# EAGLE design Dramco UNO (EAGLE 7.3.0)

## Sheet 1 of 2
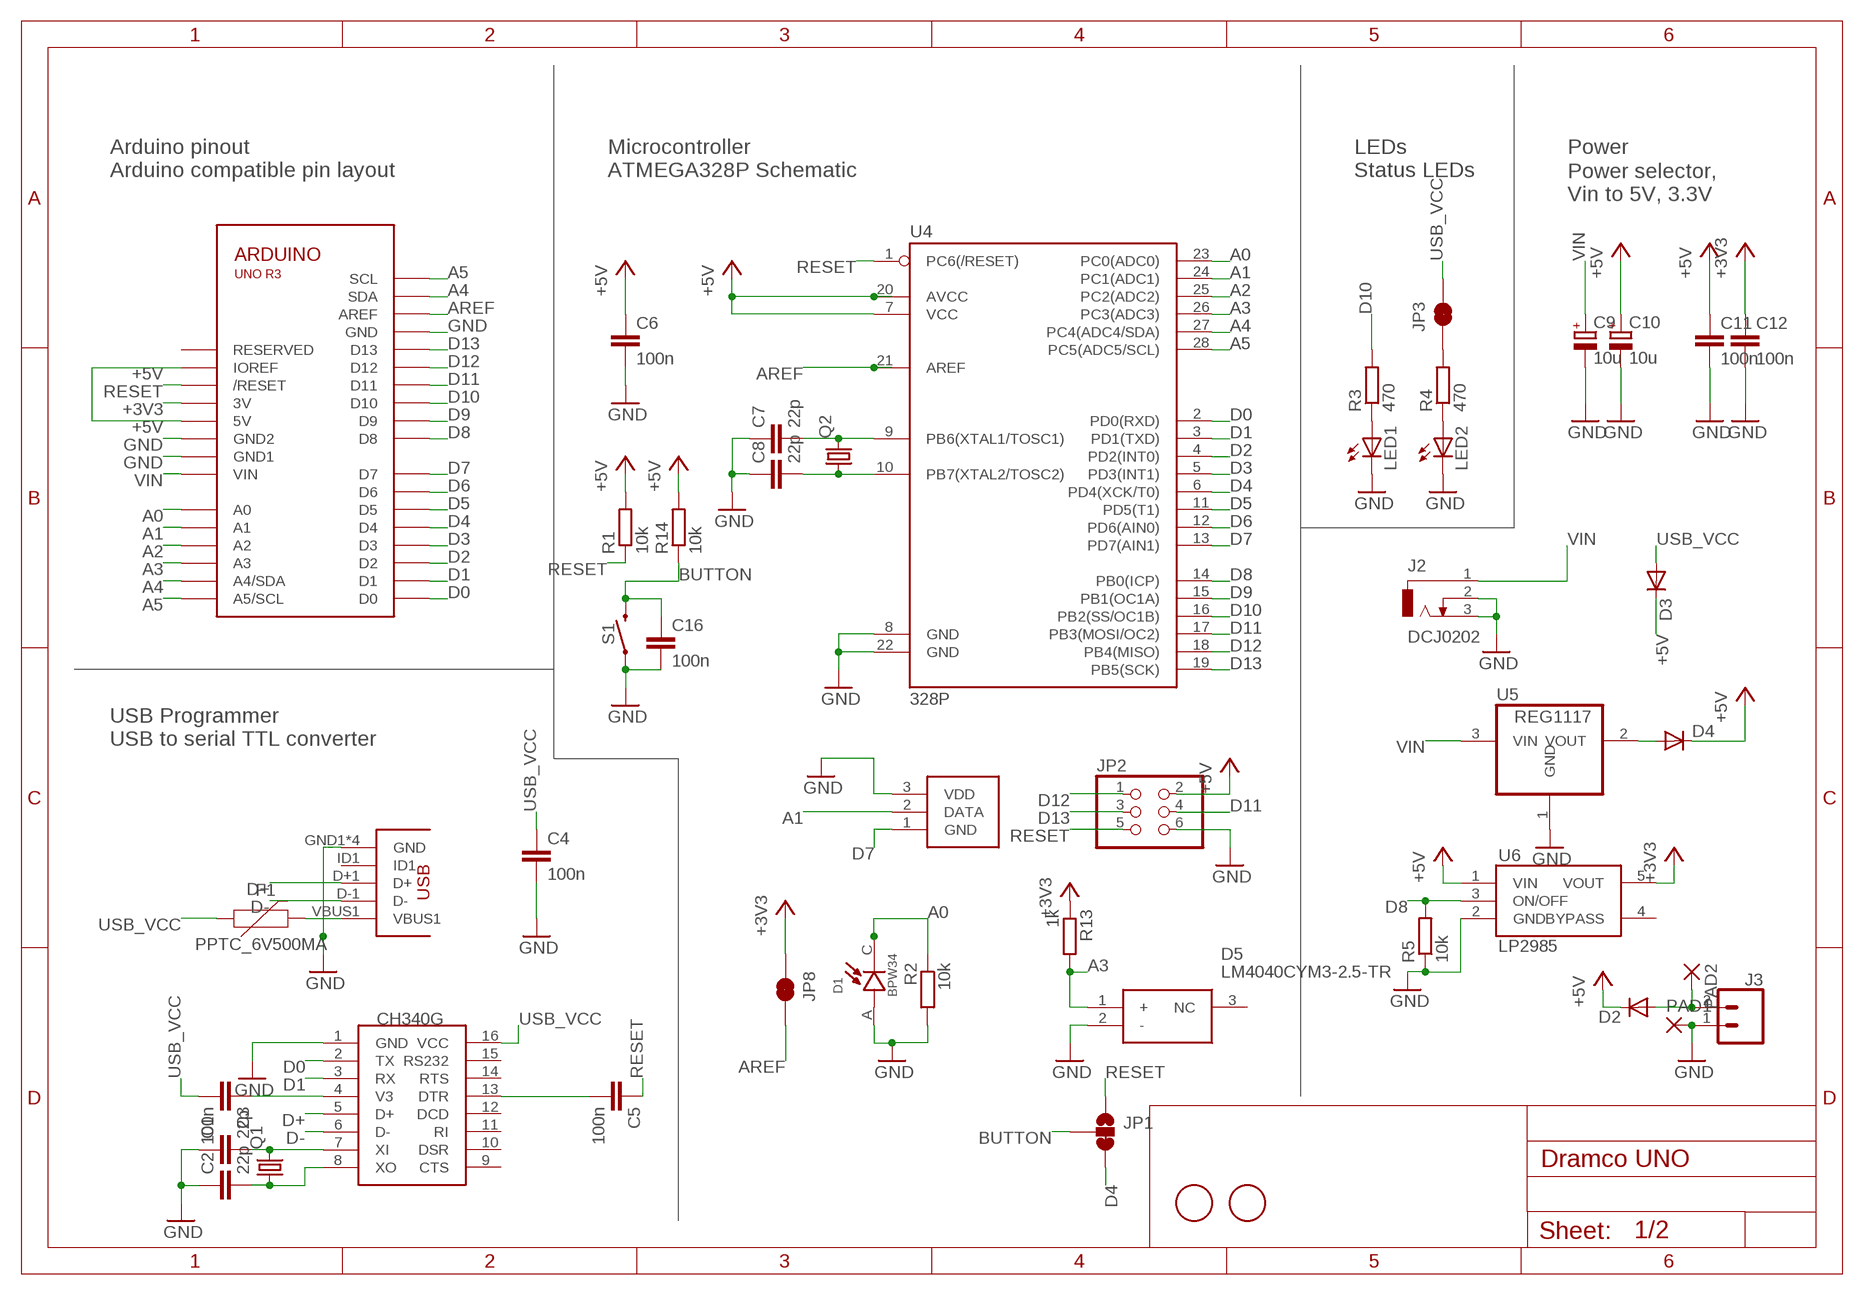
[diagram p0: schematic, sheet 1]

### Parts
C1  22p  C-EU025-024X044  [C025-024X044]
C2  22p  C-EU025-024X044  [C025-024X044]
C3  100n  C-EUC0603  [C0603]
C4  100n  C-EUC0603  [C0603]
C5  100n  C-EUC0603  [C0603]
C6  100n  C-EU025-024X044  [C025-024X044]
C7  22p  C-EU025-024X044  [C025-024X044]
C8  22p  C-EU025-024X044  [C025-024X044]
C9  10u  CPOL-EUE2-4  [E2-4]
C10  10u  CPOL-EUE2-4  [E2-4]
C11  100n  C-EUC0603  [C0603]
C12  100n  C-EUC0603  [C0603]
C16  100n  C-EUC0603  [C0603]
D1  BPW34  [DIO_BPW34]
D2  DIODE-D-5  [D-5]
D3  DIODE-D-5  [D-5]
D4  DIODE-D-5  [D-5]
D5  LM4040CYM3-2.5-TR  [SOT95P235X111-3N]
F1  PPTC_6V500MA  [0805]
J1  USB-AB  [USB-AB-MICRO-SMD_V02_BOSS]
J2  DCJ0202  [DCJ0202]
J3  CONN_02JST-PTH-2  [JST-2-PTH]
JP1  JUMPER-SMT_3_1-NC_TRACE_SILK  [SMT-JUMPER_3_1-NC_TRACE_SILK]
JP2  PINHD-2X3  [2X03]
JP3  JUMPER-SMT_2_NC_TRACE_NO-SILK  [SMT-JUMPER_2_NC_TRACE_NO-SILK]
JP8  JUMPER-SMT_2_NC_TRACE_NO-SILK  [SMT-JUMPER_2_NC_TRACE_NO-SILK]
LED1  LED5MM  [LED5MM]
LED2  LED5MM  [LED5MM]
PAD1  SMD2  [SMD1,27-2,54]
PAD2  SMD2  [SMD1,27-2,54]
Q1  CRYSTALHC49S  [HC49/S]
Q2  CRYSTALHC49S  [HC49/S]
R1  10k  R-EU_0204/7  [0204/7]
R2  10k  R-EU_0204/7  [0204/7]
R3  470  R-EU_0204/7  [0204/7]
R4  470  R-EU_0204/7  [0204/7]
R5  10k  R-EU_R0603  [R0603]
R13  1k  R-EU_R0603  [R0603]
R14  10k  R-EU_R0603  [R0603]
S1  MOMENTARY-SWITCH-SPST-PTH-6.0MM  [TACTILE_SWITCH_PTH_6.0MM]
U1  ARDUINOR3-DIMENSION  [ARDUINOR3]
U2  CH340G  [SOIC16]
U3  DS18B20-TO92  [TO92-]
U4  328P  ATMEGA328P_PDIP  [DIP28]
U5  REG1117  [SOT223]
U6  LP2985AIM5-3.3  [SOT25]
X1  FIDUCIAL  [FIDUCIAL_1MM]
X2  FIDUCIAL  [FIDUCIAL_1MM]

### Nets
+3V3: C12.1 JP8.1 R13.1 U1.3V U6.5(VOUT) ; also sheet 2
+5V: C6.1 C10.+ C11.1 D2.C D3.C D4.C JP2.2 R1.2 R14.2 U1.5V U1.IOREF U4.7(VCC) U4.20(AVCC) U6.1(VIN) ; also sheet 2
A0: D1.C R2.1 U1.A0 U4.23(PC0(ADC0))
A1: U1.A1 U3.2(DATA) U4.24(PC1(ADC1))
A2: U1.A2 U4.25(PC2(ADC2))
A3: D5.1(+) R13.2 U1.A3 U4.26(PC3(ADC3))
A4: U1.A4(A4/SDA) U1.SDA U4.27(PC4(ADC4/SDA)) ; also sheet 2
A5: U1.A5(A5/SCL) U1.SCL U4.28(PC5(ADC5/SCL)) ; also sheet 2
AREF: JP8.2 U1.AREF U4.21(AREF)
BUTTON: C16.1 JP1.2 R14.1 S1.3
D0: U1.D0 U2.2(TX) U4.2(PD0(RXD))
D1: U1.D1 U2.3(RX) U4.3(PD1(TXD))
D2: U1.D2 U4.4(PD2(INT0)) ; also sheet 2
D3: U1.D3 U4.5(PD3(INT1)) ; also sheet 2
D4: JP1.3 U1.D4 U4.6(PD4(XCK/T0)) ; also sheet 2
D5: U1.D5 U4.11(PD5(T1)) ; also sheet 2
D6: U1.D6 U4.12(PD6(AIN0)) ; also sheet 2
D7: U1.D7 U3.1(GND) U4.13(PD7(AIN1))
D8: R5.2 U1.D8 U4.14(PB0(ICP)) U6.3(ON/OFF)
D9: U1.D9 U4.15(PB1(OC1A)) ; also sheet 2
D10: R3.2 U1.D10 U4.16(PB2(SS/OC1B))
D11: JP2.4 U1.D11 U4.17(PB3(MOSI/OC2)) ; also sheet 2
D12: JP2.1 U1.D12 U4.18(PB4(MISO)) ; also sheet 2
D13: JP2.3 U1.D13 U4.19(PB5(SCK)) ; also sheet 2
D+: J1.D+1(D+) U2.5(D+)
D-: J1.D-1(D-) U2.6(D-)
GND: C1.1 C2.1 C4.2 C6.2 C7.1 C8.1 C9.- C10.- C11.2 C12.2 C16.2 D1.A D5.2(-) J1.GND1(GND) J1.P$1(GND) J1.P$2(GND) J1.P$3(GND) J2.2 J2.3 J3.1 JP2.6 LED1.K(C) LED2.K(C) PAD1.1(P) R2.2 R5.1 S1.1 U1.GND U1.GND1 U1.GND2 U2.1(GND) U3.3(VDD) U4.8(GND) U4.22(GND) U5.1(GND) U6.2(GND) ; also sheet 2
N$1: C7.2 Q2.2 U4.9(PB6(XTAL1/TOSC1))
N$2: C8.2 Q2.1 U4.10(PB7(XTAL2/TOSC2))
N$3: C1.2 Q1.2 U2.7(XI)
N$4: C2.2 Q1.1 U2.8(XO)
N$5: C3.1 U2.4(V3)
N$6: LED1.A R3.1
N$7: LED2.A R4.1
N$8: C5.2 U2.13(DTR)
N$9: D4.A U5.2(VOUT)
N$10: F1.2 J1.VBUS1
N$12: JP3.1 R4.2
RESET: C5.1 JP1.1 JP2.5 R1.1 U1.RESET(/RESET) U4.1(PC6(/RESET))
USB_VCC: C3.2 C4.1 D3.A F1.1 JP3.2 U2.16(VCC)
VBAT: D2.A J3.2 PAD2.1(P)
VIN: C9.+ J2.1 U1.VIN U5.3(VIN)
Unconnected: D5.3(NC) J1.ID1 U1.RESERVED U2.9(CTS) U2.10(DSR) U2.11(RI) U2.12(DCD) U2.14(RTS) U2.15(RS232) U6.4(BYPASS)

### Notes on the sheet
- Arduino pinout | Microcontroller | LEDs | Power
- Power selector, 
  Vin to 5V, 3.3V
- Arduino compatible pin layout | ATMEGA328P Schematic | Status LEDs
- USB Programmer
- USB to serial TTL converter

## Sheet 2 of 2
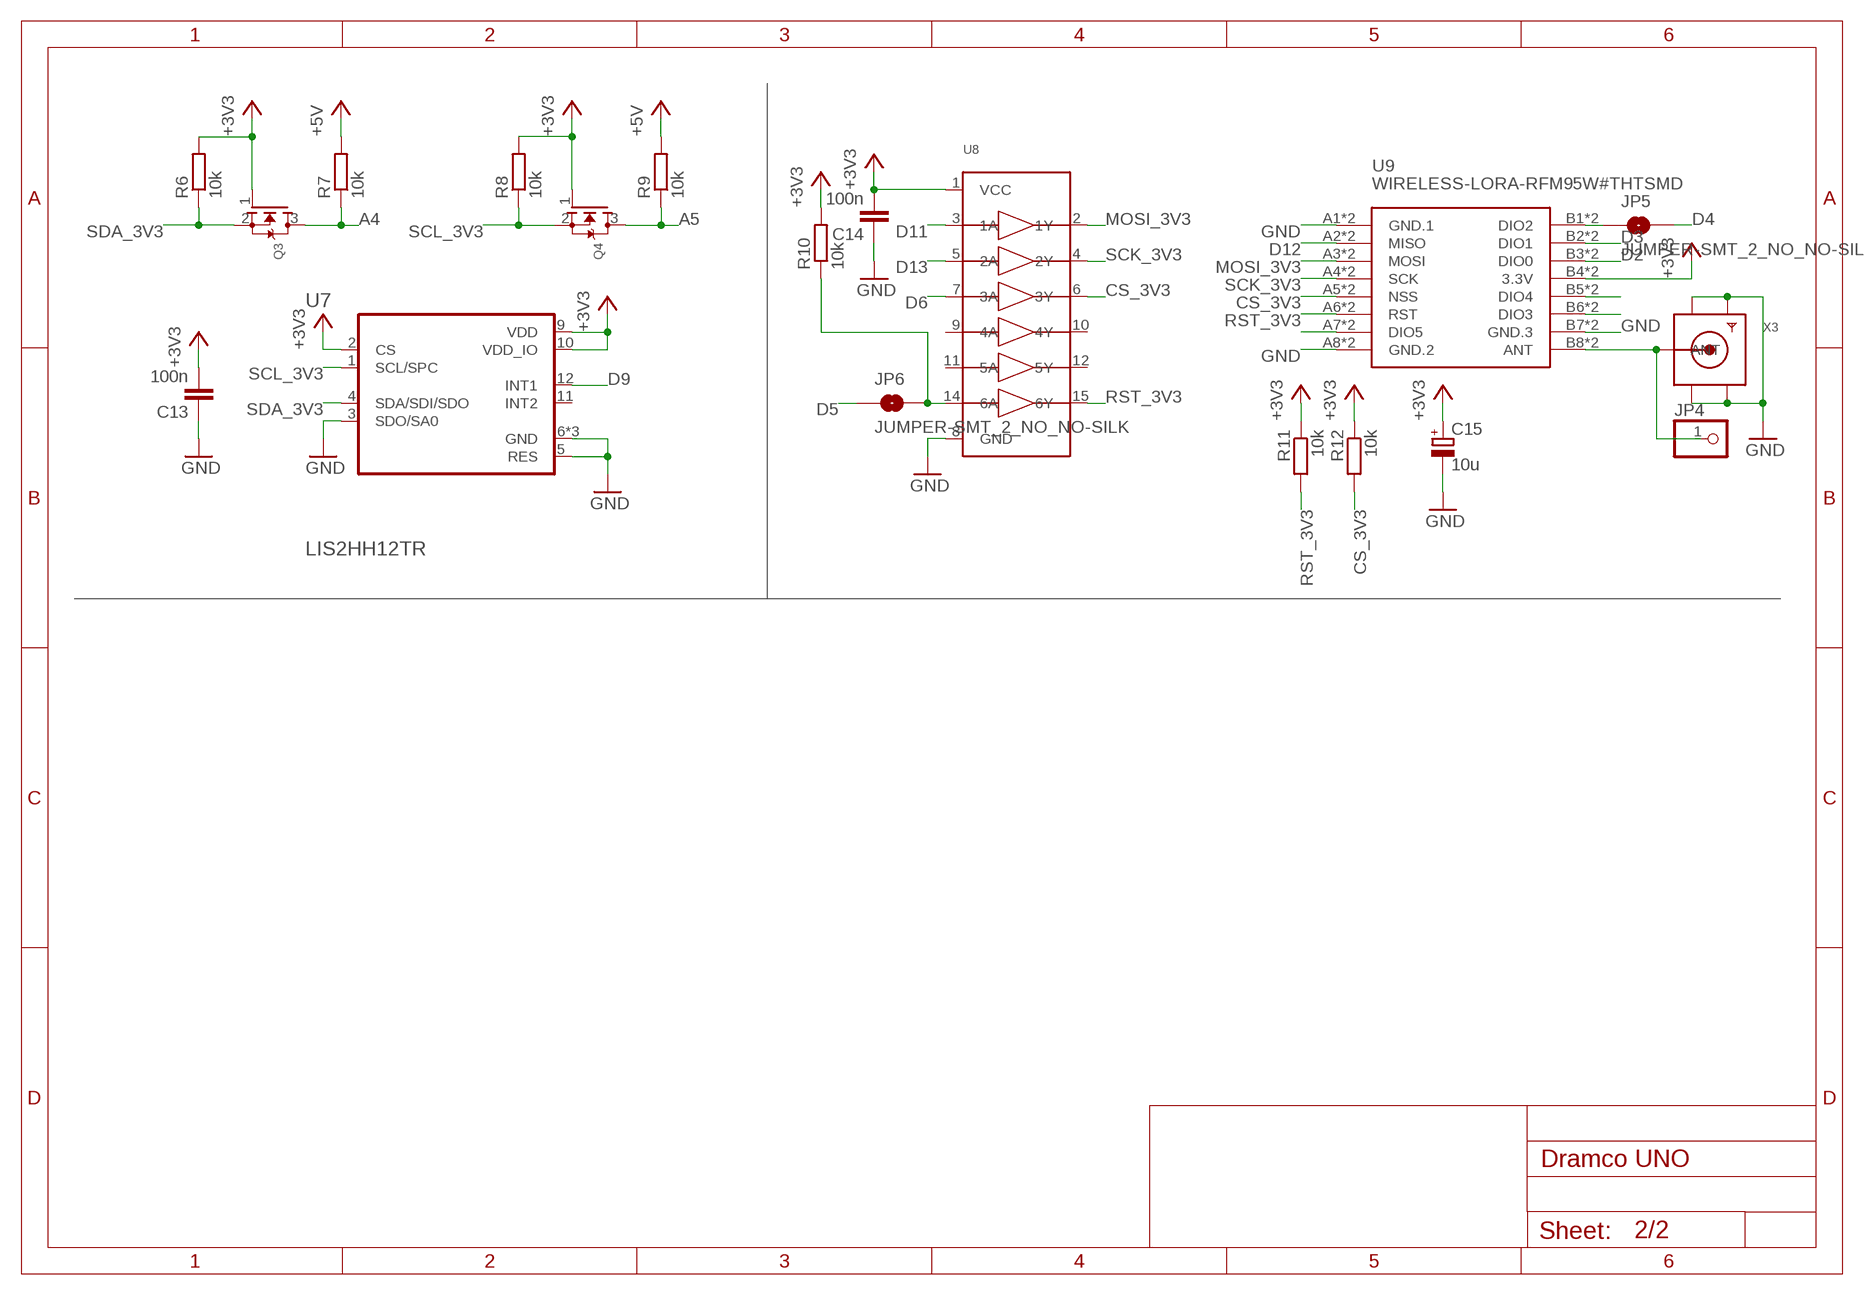
[diagram p1: schematic, sheet 2]

### Parts
C13  100n  C-EUC0603  [C0603]
C14  100n  C-EUC0603  [C0603]
C15  10u  CPOL-EUE2-4  [E2-4]
JP4  PINHD-1X1  [1X01]
JP5  JUMPER-SMT_2_NO_NO-SILK  [SMT-JUMPER_2_NO_NO-SILK]
JP6  JUMPER-SMT_2_NO_NO-SILK  [SMT-JUMPER_2_NO_NO-SILK]
Q3  MOSFET-NREFLOW  [SOT23]
Q4  MOSFET-NREFLOW  [SOT23]
R6  10k  R-EU_R0603  [R0603]
R7  10k  R-EU_R0603  [R0603]
R8  10k  R-EU_R0603  [R0603]
R9  10k  R-EU_R0603  [R0603]
R10  10k  R-EU_R0603  [R0603]
R11  10k  R-EU_0204/7  [0204/7]
R12  10k  R-EU_0204/7  [0204/7]
U7  LIS2HH12TR  [PQFN50P200X200X100-12N]
U8  74HC4050DTSSOP  [TSSOP16]
U9  WIRELESS-LORA-RFM95W#THTSMD  [WIRELESS-LORA-RFM95W#THTSMD]
X3  SMACONNECTOR_EDGE_UFL  [SMA_EDGELAUNCH_UFL]

### Nets
+3V3: C13.2 C14.2 C15.+ Q3.1(G) Q4.1(G) R6.2 R8.2 R10.2 R11.1 R12.1 U7.2(CS) U7.9(VDD) U7.10(VDD_IO) U8.1(VCC) U9.B4(3.3V) U9.B12(3.3V) ; also sheet 1
+5V: R7.2 R9.2 ; also sheet 1
A4: Q3.3(D) R7.1 ; also sheet 1
A5: Q4.3(D) R9.1 ; also sheet 1
CS_3V3: R12.2 U8.6(3Y) U9.A5(NSS) U9.A13(NSS)
D2: U9.B3(DIO0) U9.B11(DIO0) ; also sheet 1
D3: U9.B2(DIO1) U9.B10(DIO1) ; also sheet 1
D4: JP5.2 ; also sheet 1
D5: JP6.1 ; also sheet 1
D6: U8.7(3A) ; also sheet 1
D9: U7.12(INT1) ; also sheet 1
D11: U8.3(1A) ; also sheet 1
D12: U9.A2(MISO) U9.A10(MISO) ; also sheet 1
D13: U8.5(2A) ; also sheet 1
GND: C13.1 C14.1 C15.- U7.3(SDO/SA0) U7.5(RES) U7.6(GND) U7.7(GND) U7.8(GND) U8.8(GND) U9.A1(GND.1) U9.A8(GND.2) U9.A9(GND.1) U9.A16(GND.2) U9.B7(GND.3) U9.B15(GND.3) X3.GND@1(GND1) X3.GND@2(GND2) X3.GND@3(GND3) X3.GND@4(GND4) ; also sheet 1
MOSI_3V3: U8.2(1Y) U9.A3(MOSI) U9.A11(MOSI)
N$11: JP4.1 U9.B8(ANT) U9.B16(ANT) X3.P(ANT)
N$13: JP5.1 U9.B1(DIO2) U9.B9(DIO2)
N$14: JP6.2 R10.1 U8.14(6A)
N$25: U9.A7(DIO5) U9.A15(DIO5)
N$30: U9.B5(DIO4) U9.B13(DIO4)
N$31: U9.B6(DIO3) U9.B14(DIO3)
RST_3V3: R11.2 U8.15(6Y) U9.A6(RST) U9.A14(RST)
SCK_3V3: U8.4(2Y) U9.A4(SCK) U9.A12(SCK)
SCL_3V3: Q4.2(S) R8.1 U7.1(SCL/SPC)
SDA_3V3: Q3.2(S) R6.1 U7.4(SDA/SDI/SDO)
Unconnected: U7.11(INT2) U8.9(4A) U8.10(4Y) U8.11(5A) U8.12(5Y)

## Library data of the parts
C1-C8 C16 = resistor:C-EU: CAPACITOR, European symbol
C9 C10 C15 = rcl:CPOL-EU: POLARIZED CAPACITOR, European symbol
C11-C14 = rcl:C-EU: CAPACITOR, European symbol
D1 = BPW34:BPW34: PIN IR photodiode; DIL; 400-1100nm; 150mW; 60°; λp max:; AVAILABILITY: Unavailable; DESCRIPTION: PIN IR photodiode; DIL; 400-1100nm; 150mW; 60°; λp max:; MF: Vishay Semiconductor; MP: BPW34; PACKAGE: DIP-2 Osram Opto; PRICE: None
D2-D4 = diode:DIODE-: DIODE
D5 = SamacSys_Parts:LM4040CYM3-2.5-TR: Voltage References Source: Datasheet <https://componentsearchengine.com/Datasheets/1/LM4040CYM3-2.5-TR.pdf>; DESCRIPTION: Voltage References; HEIGHT: 1.11mm; MANUFACTURER_NAME: Microchip; MANUFACTURER_PART_NUMBER: LM4040CYM3-2.5-TR; MOUSER_PART_NUMBER: 998-LM4040CYM3-2.5TR; MOUSER_PRICE-STOCK: https://www.mouser.co.uk/ProductDetail/Microchip-Technology-Micrel/LM4040CYM3-25-TR/?qs=Y3Q3JoKAO1TBY3WS5dYgqA%3D%3D
F1 = SparkFun-Fuses:PPTC: Resettable Fuse PPTC Resettable Fuse. Really a sort of resistor with a polymeric positive temperature coefficient whose resistance increases dramatically with an increase in temperature. When heated by the power passing through the resistance rises causing the current to be limited, protecting the circuit. This is achieved by the transition of the polymer from a crystalline to an amorphous state where the conductive carbon separates breaking the conductive pathways found in the cool crystalline structure. When a PPTC cools back down it resumes conducting letting the circuit turn back on. SparkFun Products: SparkFun RedBoard - Programmed with Arduino <https://www.sparkfun.com/products/12757> Pro Micro - 5V/16MHz <https://www.sparkfun.com/products/12640> Arduino Pro 328 - 5V/16MHz <https://www.sparkfun.com/products/10915> MP3 Trigger <https://www.sparkfun.com/products/13720>
J1 = Testing:USB-AB
J2 = con-jack:DCJ0202: DC POWER JACK Source: DCJ0202.pdf; OC_FARNELL: unknown; OC_NEWARK: unknown
J3 = SparkFun-Connectors:CONN_02: Multi connection point. Often used as Generic Header-pin footprint for 0.1 inch spaced/style header connections On any of the 0.1 inch spaced packages, you can populate with these: Break Away Headers - Straight <https://www.sparkfun.com/products/116> (PRT-00116) Break Away Male Headers - Right Angle <https://www.sparkfun.com/products/553> (PRT-00553) Female Headers <https://www.sparkfun.com/products/115> (PRT-00115) Break Away Headers - Machine Pin <https://www.sparkfun.com/products/117> (PRT-00117) Break Away Female Headers - Swiss Machine Pin <https://www.sparkfun.com/products/743> (PRT-00743) For SCREWTERMINALS and SPRING TERMINALS visit here: Screw Terimnals on SparkFun.com <https://www.sparkfun.com/search/results?term=Screw+Terminals> (5mm/3.5mm/2.54mm spacing) This device is also useful as a general connection point to wire up your design to another part of your project. Our various solder wires solder well into these plated through hole pads. Hook-Up Wire - Assortment (Stranded, 22 AWG) <https://www.sparkfun.com/products/11375> (PRT-11375) Hook-Up Wire - Assortment (Solid Core, 22 AWG) <https://www.sparkfun.com/products/11367> (PRT-11367) View the entire wire category on our website here <https://www.sparkfun.com/categories/141> Special notes: Molex polarized connector foot print use with: PRT-08233 with associated crimp pins and housings. 2.54_SCREWTERM for use with PRT-10571. 3.5mm Screw Terminal footprints for PRT-08084 5mm Screw Terminal footprints for use with PRT-08432; PROD_ID: CONN-09863; SKU: PRT-09914
JP1 = SparkFun-Jumpers:JUMPER-SMT_3_1-NC_TRACE: Normally closed trace jumper (1 of 2 connections) This jumper has a trace between two pads so it's normally closed (NC). The other connection is normally open (NO). Use a razor knife to open the connection. For best results follow the IPC guidelines for cutting traces: Cutout at least 0.063 mm (0.005 in). Remove all loose material to clean up the cut area. Seal the cut with an approved epoxy. Reapply solder to reclose the connection, or to close the NO connection.
JP2 = pinhead:PINHD-2X3: PIN HEADER
JP3 JP8 = SparkFun-Jumpers:JUMPER-SMT_2_NC_TRACE: Normally closed trace jumper This jumper has a trace between two pads so it's normally closed (NC). Use a razor knife to open the connection. For best results follow the IPC guidelines for cutting traces: Cutout at least 0.063 mm (0.005 in). Remove all loose material to clean up the cut area. Seal the cut with an approved epoxy. Reapply solder to reclose the connection.
JP4 = pinhead:PINHD-1X1: PIN HEADER
JP5 JP6 = SparkFun-Jumpers:JUMPER-SMT_2_NO: Normally open jumper This jumper has two pads in close proximity to each other. Apply solder to close the connection. Round pads are easier to solder for beginners, but are a lot larger. SparkFun Product that uses the round pads: SparkFun EL Sequencer <https://www.sparkfun.com/products/12781>
LED1 LED2 = adafruit:LED: LED OSRAM: - CHIPLED LG R971, LG N971, LY N971, LG Q971, LY Q971, LO R971, LY R971 LH N974, LH R974 LS Q976, LO Q976, LY Q976 LO Q996 - Hyper CHIPLED LW Q18S LB Q993, LB Q99A, LB R99A - SideLED LS A670, LO A670, LY A670, LG A670, LP A670 LB A673, LV A673, LT A673, LW A673 LH A674 LY A675 LS A676, LA A676, LO A676, LY A676, LW A676 LS A679, LY A679, LG A679 - Hyper Micro SIDELED® LS Y876, LA Y876, LO Y876, LY Y876 LT Y87S - SmartLED LW L88C, LW L88S LB L89C, LB L89S, LG L890 LS L89K, LO L89K, LY L89K LS L896, LA L896, LO L896, LY L896 - TOPLED LS T670, LO T670, LY T670, LG T670, LP T670 LSG T670, LSP T670, LSY T670, LOP T670, LYG T670 LG T671, LOG T671, LSG T671 LB T673, LV T673, LT T673, LW T673 LH T674 LS T676, LA T676, LO T676, LY T676, LB T676, LH T676, LSB T676, LW T676 LB T67C, LV T67C, LT T67C, LS T67K, LO T67K, LY T67K, LW E67C LS E67B, LA E67B, LO E67B, LY E67B, LB E67C, LV E67C, LT E67C LW T67C LS T679, LY T679, LG T679 LS T770, LO T770, LY T770, LG T770, LP T770 LB T773, LV T773, LT T773, LW T773 LH T774 LS E675, LA E675, LY E675, LS T675 LS T776, LA T776, LO T776, LY T776, LB T776 LHGB T686 LT T68C, LB T68C - Hyper Mini TOPLED® LB M676 - Mini TOPLED Santana® LG M470 LS M47K, LO M47K, LY M47K Source: http://www.osram.convergy.de/
PAD1 PAD2 = wirepad:SMD2: SMD PAD
Q1 Q2 = adafruit:CRYSTAL: CRYSTAL; OC_FARNELL: 1667008; OC_NEWARK: unknown
Q3 Q4 = adafruit:MOSFET-N: N-Channel Mosfet 2N7002E - 60V 260mA SOT23 [Digikey: 2N7002ET1GOSTR-ND] - REEL BSH103 - 30V 850mA SOT23 [Digikey: 568-5013-1-ND]
R1-R4 R11 R12 = resistor:R-EU_: RESISTOR, European symbol
R5-R10 R13 R14 = rcl:R-EU_: RESISTOR, European symbol
S1 = SparkFun-Switches:MOMENTARY-SWITCH-SPST: Momentary Switch (Pushbutton) - SPST Normally-open (NO) SPST momentary switches (buttons, pushbuttons). Variants PTH-12MM - 12mm square, through-hole Momentary Pushbutton Switch - 12mm Square <https://www.sparkfun.com/products/9190> (COM-09190) PTH-6.0MM, PTH-6.0MM-KIT - 6.0mm square, through-hole Mini Pushbutton Switch <https://www.sparkfun.com/products/97> (COM-00097) KIT package intended for soldering kit's - only one side of pads' copper is exposed. PTH-RIGHT-ANGLE-KIT - Right-angle, through-hole Right Angle Tactile Button <https://www.sparkfun.com/products/10791> - Used on SparkFun BigTime Watch Kit <https://www.sparkfun.com/products/11734> SMD-12MM - 12mm square, surface-mount Tactile Button - SMD (12mm) <https://www.sparkfun.com/products/12993> (COM-12993) Used on SparkFun PicoBoard <https://www.sparkfun.com/products/11888> SMD-4.5MM - 4.5mm Square Trackball Switch Used on SparkFun Blackberry Trackballer Breakout <https://www.sparkfun.com/products/13169> SMD-4.6MMX2.8MM - 4.60mm x 2.80mm, surface mount Used on SparkFun SAMD21 Mini Breakout <https://www.sparkfun.com/products/13664> SMD-5.2MM, SMD-5.2-REDUNDANT - 5.2mm square, surface-mount Mini Pushbutton Switch - SMD <https://www.sparkfun.com/products/8720> (COM-08720) Used on Arduino Pro Mini <https://www.sparkfun.com/products/11114> REDUNDANT package connects both switch circuits together SMD-6.0X3.5MM - 6.0 x 3.5mm, surface mount Momentary Reset Switch SMD <https://www.sparkfun.com/products/8229> (COM-08229) SMD-6.2MM-TALL - 6.2mm square, surface mount Tactile Button - SMD (6mm) <https://www.sparkfun.com/products/12992> Used on SparkFun Digital Sandbox <https://www.sparkfun.com/products/12651> SMD-RIGHT-ANGLE - Right-angle, surface mount Used on SparkFun Block for Intel® Edison - Arduino <https://www.sparkfun.com/products/13036>; PROD_ID: SWCH-08441; SF_SKU: COM-00097
U1 = adafruit:ARDUINOR3: This is a new object for the new Arduino R3 - with extra pins that you may want to use (such as IOref, and duplicated A4/A5
U2 = ch340g:CH340G
U3 = 1wire:DS18B20-
U4 = SparkFun-IC-Microcontroller:ATMEGA328P_PDIP: Atmel 328P Through hole ATMEGA328P uC used in the Arduino 32kb flash, 1k EEPROM, 2k SRAM Datasheet <http://www.sparkfun.com/datasheets/Components/SMD/ATMega328.pdf> SparkFun Products Storefront component: AVR 28 Pin 20MHz 32K 6A/D - ATMega328P <https://www.sparkfun.com/products/9061> (COM-09061) SparkFun Simon Says - Through-Hole Soldering Kit <https://www.sparkfun.com/products/10547> (KIT-10547) SparkFun Learn to Solder - Simon Says <https://www.sparkfun.com/products/13708> (KIT-13708) SparkFun BigTime Watch Kit <https://www.sparkfun.com/products/11734> (KIT-11734) SparkFun ClockIt <https://www.sparkfun.com/products/10930> (KIT-10930) SparkFun Serial Enabled LCD Kit <https://www.sparkfun.com/products/10097> (LCD-10097) SparkFun Simon Tilts - Through Hole Soldering Kit <https://www.sparkfun.com/products/12634> (KIT-12634) SparkFun Frequency Counter Kit <https://www.sparkfun.com/products/10140> (KIT-10140) FabFM Radio Kit <https://www.sparkfun.com/products/11043> (KIT-11043) SparkFun Binary Blaster Kit <https://www.sparkfun.com/products/12037> (KIT-12037) SparkFun Metro-Gnome <https://www.sparkfun.com/products/9236> (KIT-09236) ATmega328 with Arduino Optiboot (Uno) <https://www.sparkfun.com/products/10524> (DEV-10524); PROD_ID: IC-09136
U5 = burr-brown:REG1117: 800mA and 1A Low Dropout (LDO) Positive Regulator 1.8V, 2.5V, 2.85V, 3.3V, 5V, and Adj; MPN: REG1117; OC_FARNELL: 1097566; OC_NEWARK: 14P6981
U6 = LP2985:LP2985: LP2985-N Micropower 150 mA Low-Noise Ultra Low-Dropout Regulator
U7 = LIS2HH12TR:LIS2HH12TR: MEMS digital output motion sensor: ultra low-power high performance 3-axes "pico" accelerometer; AVAILABILITY: Unavailable; DESCRIPTION: MEMS digital output motion sensor: ultra low-power high performance 3-axes pico accelerometer; MF: STMicroelectronics; MP: LIS2HH12TR; PACKAGE: LGA-12 STMicroelectronics; PRICE: None
U8 = microbuilder:74HC4050D: 6-channel level shifter 74HC4050D - 2V-6V Supply SOIC16 Digikey: 74HC4050D,653-ND Mouser: 771-74HC4050D-T TSSOP16 Digikey: 296-9215-1-ND Mouser:
U9 = diy-modules:WIRELESS-LORA-RFM95W: 868/915 MHz LoRa Radio Transceiver Module based on SX1276 chip Click here to find device on ebay.com <http://www.ebay.com/sch/RFM95W+transceiver>
X1 X2 = adafruit:FIDUCIAL: For use by pick and place machines to calibrate the vision/machine, 1mm By microbuilder.eu
X3 = adafruit:SMACONNECTOR: SMA Connector 90° DIP SMA Connector, 50 Ohm (4UConnector: 07259)

## Net classes
0 default: clearance 0.205 mm

## Board
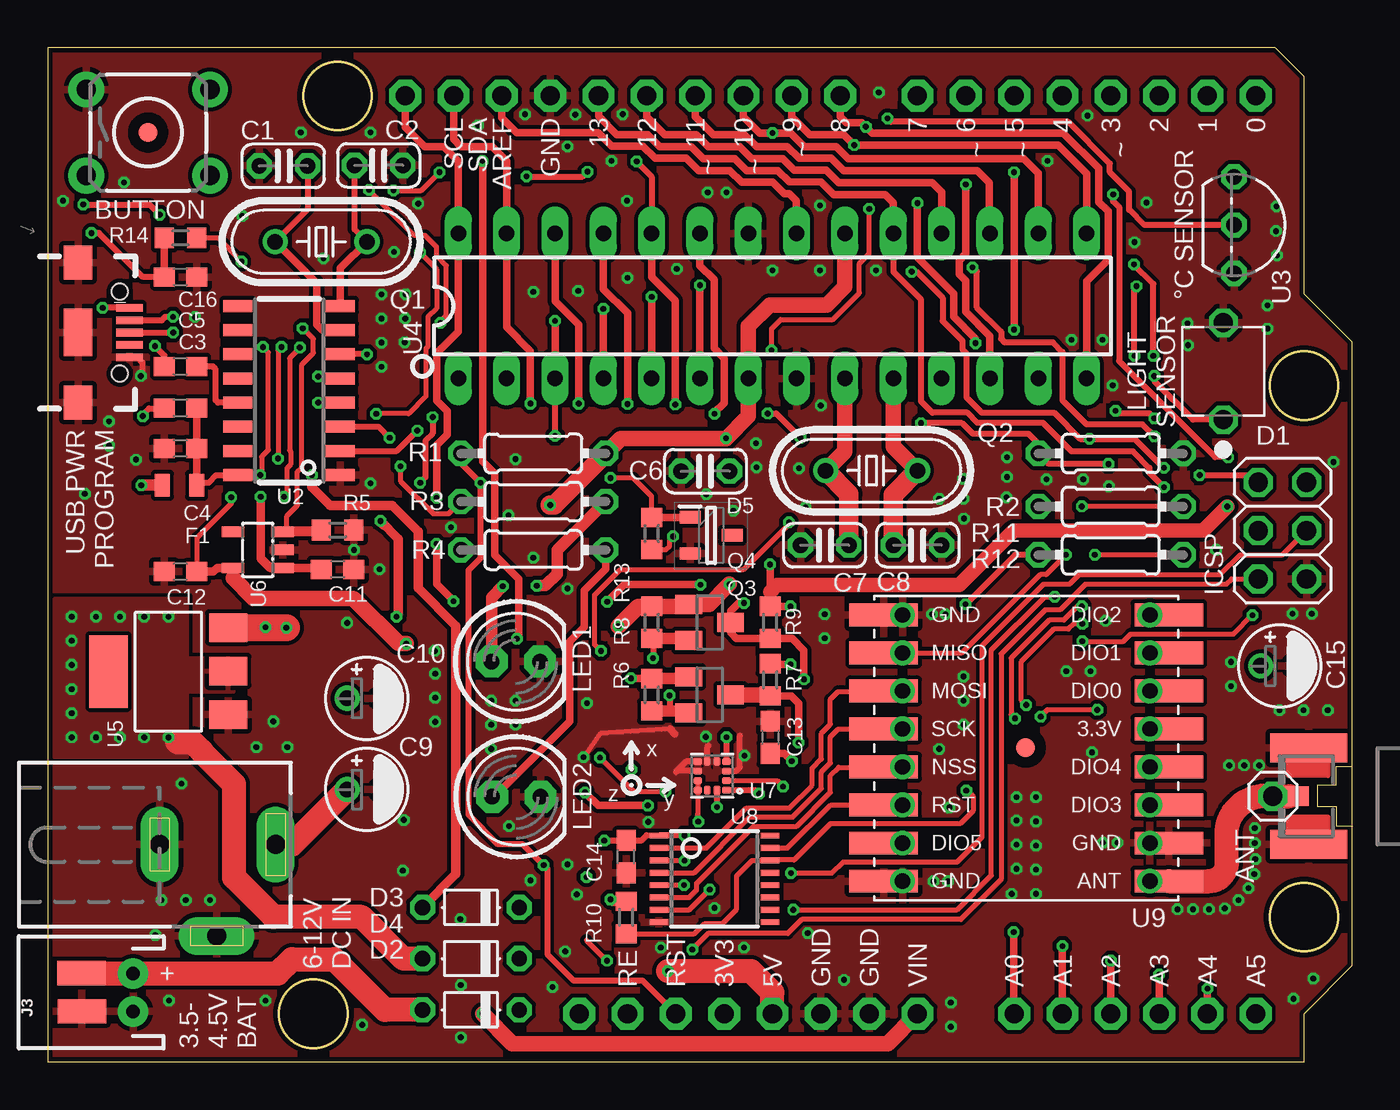
[diagram p2: board, top side]
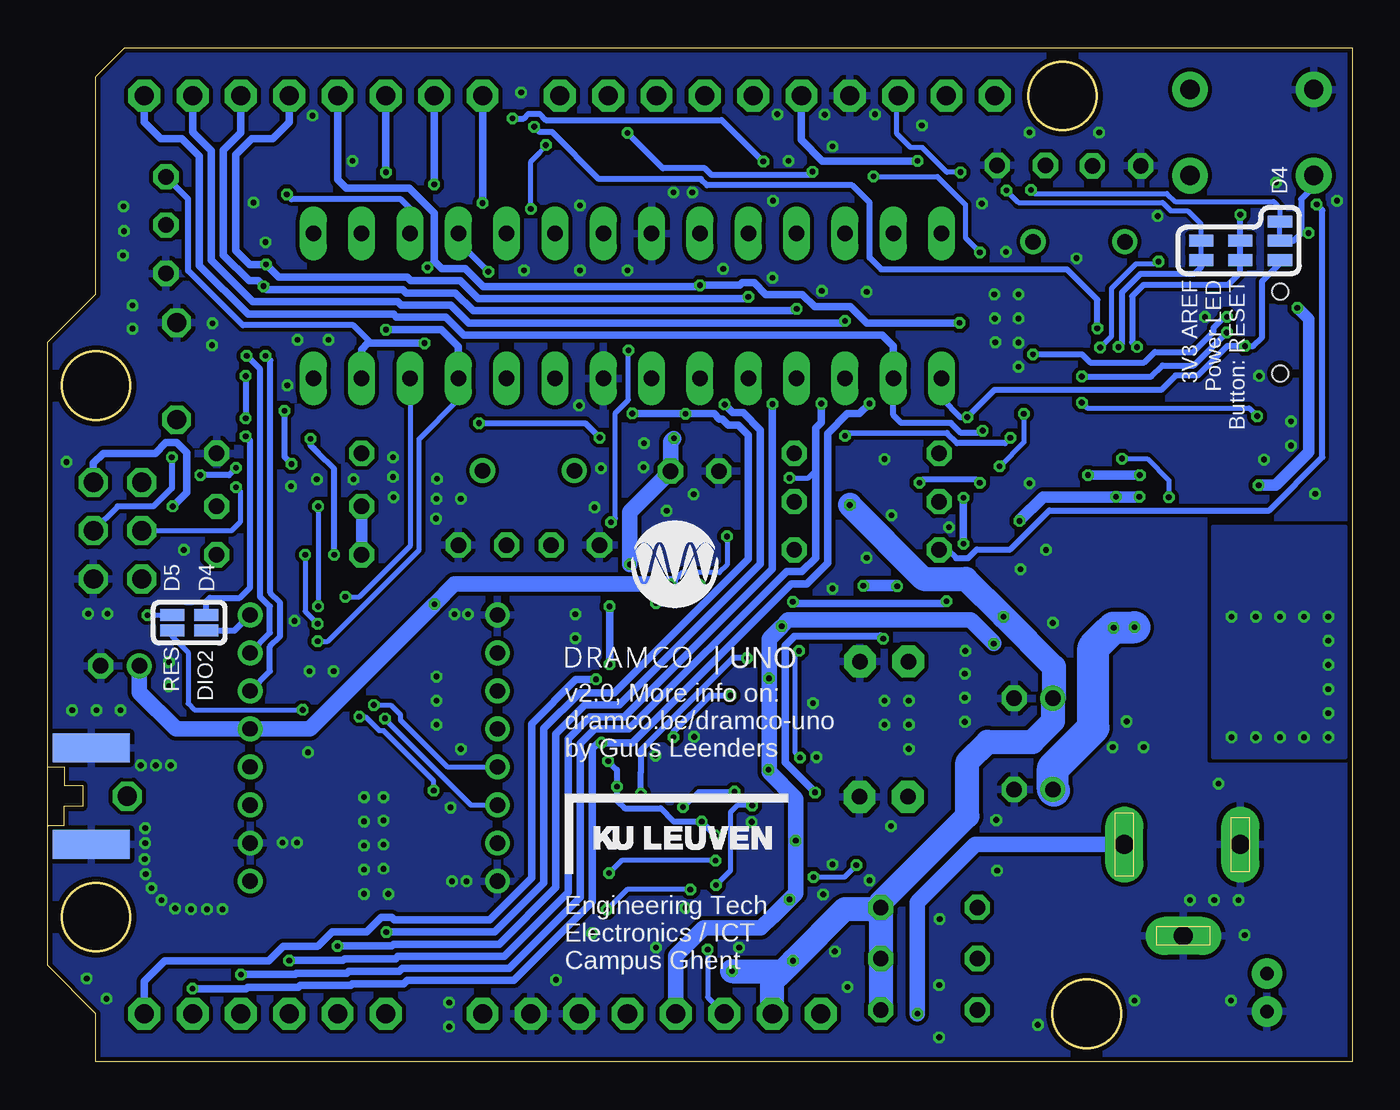
[diagram p3: board, bottom side, seen from below]

Size 68.58 x 53.34 mm. Coordinates in mm from the lower left corner, seen from the top.
Outline: 68.58,15.52 67.69,15.52 67.69,14.55 66.73,14.55 66.73,13.44 67.72,13.44 67.72,12.42 68.58,12.42 68.58,12.39
Copper layers (1*16): Top 0.035mm / dielectric 1.5mm / Bottom 0.035mm
Design rules "SeeedStudio_2layer_DRU_no_angle_20140221": minimum track width 6mil, minimum drill 12mil, track to track 6mil, track to pad 6mil, pad to pad 6mil, via to via 6mil, smd to smd 0mil, copper to edge 10mil, drill to drill 10mil, minimum pad ring 10mil, minimum via ring 6mil, stop-mask expansion 2mil, vias tented up to drill 100mil, thermal gap 10mil

### Footprints (pad centres in the part's own frame; a part is rotated, then mirrored left to right if it is on the bottom)
C025-024X044 = drill 0.813 octagon: 1 -1.27,0; 2 1.27,0
C0603 = smd 1.1 x 1: 1 -0.85,0; 2 0.85,0
E2-4 = drill 0.813 pad 1.27: + -1.016,0 | drill 0.813 pad 1.27 octagon: - 1.016,0
DIO_BPW34 = drill 1 pad 1.5 octagon: A 2.55,0; C -2.55,0
D-5 = drill 0.813 octagon: A 2.54,0; C -2.54,0
SOT95P235X111-3N = smd 1.1 x 0.65: 1 -1.1,0.95; 2 -1.1,-0.95; 3 1.1,0
0805 = smd 0.8 x 1.2: 1 -0.9,0; 2 0.9,0
USB-AB-MICRO-SMD_V02_BOSS = smd 1.4 x 0.4: D+1 2.7,0; D-1 2.7,0.65; GND1 2.7,-1.3; ID1 2.7,-0.65; VBUS1 2.7,1.3 | smd 1.5 x 2.5: P$1 0,0 | smd 1.5 x 1.8: P$2 0,-3.683; P$3 0,3.683 | hole 0.85: 2.2,2.154; 2.2,-2.154
DCJ0202 = drill 1 pad 2 long: 1 0,3.1; 2 4.8,0; 3 0,-3
JST-2-PTH = drill 0.7 pad 1.6: 1 -1,0; 2 1,0
SMT-JUMPER_3_1-NC_TRACE_SILK = smd 0.635 x 1.27: 1 -1.016,0; 2 0,0; 3 1.016,0
2X03 = drill 1.016 octagon: 1 -2.54,-1.27; 2 -2.54,1.27; 3 0,-1.27; 4 0,1.27; 5 2.54,-1.27; 6 2.54,1.27
SMT-JUMPER_2_NC_TRACE_NO-SILK = smd 0.635 x 1.27: 1 -0.508,0; 2 0.508,0
1X01 = drill 1.016 octagon: 1 0,0
SMT-JUMPER_2_NO_NO-SILK = smd 0.635 x 1.27: 1 -0.406,0; 2 0.406,0
LED5MM = drill 0.813 pad 1.676 octagon: A -1.27,0; K 1.27,0
SMD1,27-2,54 = smd 1.27 x 2.54: 1 0,0
HC49/S = drill 0.813: 1 -2.413,0; 2 2.413,0
SOT23 = smd 1 x 1.4: 1 -0.95,-1.1; 2 0.95,-1.1; 3 0,1.1
0204/7 = drill 0.813 octagon: 1 -3.81,0; 2 3.81,0
R0603 = smd 1 x 1.1: 1 -0.85,0; 2 0.85,0
TACTILE_SWITCH_PTH_6.0MM = drill 1.016 pad 1.88: 1 -3.251,2.261; 2 3.251,2.261; 3 -3.251,-2.261; 4 3.251,-2.261
ARDUINOR3 = drill 1 pad 1.676 octagon: 3V 35.56,2.54; 5V 38.1,2.54; A0 50.8,2.54; A1 53.34,2.54; A2 55.88,2.54; A3 58.42,2.54; A4 60.96,2.54; A5 63.5,2.54; AREF 23.876,50.8; D0 63.5,50.8; D1 60.96,50.8; D2 58.42,50.8; D3 55.88,50.8; D4 53.34,50.8; D5 50.8,50.8; D6 48.26,50.8; D7 45.72,50.8; D8 41.656,50.8; D9 39.116,50.8; D10 36.576,50.8; D11 34.036,50.8; D12 31.496,50.8; D13 28.956,50.8; GND 26.416,50.8; GND1 43.18,2.54; GND2 40.64,2.54; IOREF 30.48,2.54; RESERVED 27.94,2.54; RESET 33.02,2.54; SCL 18.796,50.8; SDA 21.336,50.8; VIN 45.72,2.54
SOIC16 = smd 0.635 x 1.524: 1 -4.445,-2.695; 2 -3.175,-2.695; 3 -1.905,-2.695; 4 -0.635,-2.695; 5 0.635,-2.695; 6 1.905,-2.695; 7 3.175,-2.695; 8 4.445,-2.695; 9 4.445,2.695; 10 3.175,2.695; 11 1.905,2.695; 12 0.635,2.695; 13 -0.635,2.695; 14 -1.905,2.695; 15 -3.175,2.695; 16 -4.445,2.695
TO92- = drill 0.813 octagon: 1 -2.54,0; 2 0,0; 3 2.54,0
DIP28 = drill 0.813 pad 1.422 long: 1 -16.51,-3.81; 2 -13.97,-3.81; 3 -11.43,-3.81; 4 -8.89,-3.81; 5 -6.35,-3.81; 6 -3.81,-3.81; 7 -1.27,-3.81; 8 1.27,-3.81; 9 3.81,-3.81; 10 6.35,-3.81; 11 8.89,-3.81; 12 11.43,-3.81; 13 13.97,-3.81; 14 16.51,-3.81; 15 16.51,3.81; 16 13.97,3.81; 17 11.43,3.81; 18 8.89,3.81; 19 6.35,3.81; 20 3.81,3.81; 21 1.27,3.81; 22 -1.27,3.81; 23 -3.81,3.81; 24 -6.35,3.81; 25 -8.89,3.81; 26 -11.43,3.81; 27 -13.97,3.81; 28 -16.51,3.81
SOT223 = smd 1.499 x 2.007: 1 -2.261,-3.15; 2 0.025,-3.15; 3 2.311,-3.15 | smd 3.81 x 2.007: 4 0,3.15
SOT25 = smd 0.55 x 1.2: 1 -0.95,-1.3; 2 0,-1.3; 3 0.95,-1.3; 4 0.95,1.3; 5 -0.95,1.3
PQFN50P200X200X100-12N = smd 0.45 x 0.35: 1 -0.76,0.75; 2 -0.76,0.25; 3 -0.76,-0.25; 4 -0.76,-0.75; 7 0.76,-0.75; 8 0.76,-0.25; 9 0.76,0.25; 10 0.76,0.75 | smd 0.35 x 0.45: 5 -0.25,-0.76; 6 0.25,-0.76; 11 0.25,0.76; 12 -0.25,0.76
TSSOP16 = smd 0.305 x 0.991: 1 -2.275,-2.918; 2 -1.625,-2.918; 3 -0.975,-2.918; 4 -0.325,-2.918; 5 0.325,-2.918; 6 0.975,-2.918; 7 1.625,-2.918; 8 2.275,-2.918; 9 2.275,2.918; 10 1.625,2.918; 11 0.975,2.918; 12 0.325,2.918; 13 -0.325,2.918; 14 -0.975,2.918; 15 -1.625,2.918; 16 -2.275,2.918
WIRELESS-LORA-RFM95W#THTSMD = smd 3.6 x 1.2: A1 -7.5,7; A2 -7.5,5; A3 -7.5,3; A4 -7.5,1; A5 -7.5,-1; A6 -7.5,-3; A7 -7.5,-5; A8 -7.5,-7; B1 7.5,7; B2 7.5,5; B3 7.5,3; B4 7.5,1; B5 7.5,-1; B6 7.5,-3; B7 7.5,-5; B8 7.5,-7 | drill 0.8: A9 -6.5,7; A10 -6.5,5; A11 -6.5,3; A12 -6.5,1; A13 -6.5,-1; A14 -6.5,-3; A15 -6.5,-5; A16 -6.5,-7; B9 6.5,7; B10 6.5,5; B11 6.5,3; B12 6.5,1; B13 6.5,-1; B14 6.5,-3; B15 6.5,-5; B16 6.5,-7
FIDUCIAL_1MM = smd 1 x 1: 1 0,0
SMA_EDGELAUNCH_UFL = smd 4.064 x 1.524: GND@1 2.032,-2.54; GND@2 2.032,2.54 | smd 4.064 x 1.524 bottom: GND@3 2.032,2.54; GND@4 2.032,-2.54 | smd 2.032 x 1.016: P 3.048,0

### Placement (x,y rotation side)
C1  12.4,47.12 0 top
C2  17.4,47.14 180 top
C3  6.99,34.39 0 top
C4  6.99,32.26 180 top
C5  6.99,36.58 0 top
C6  34.57,31.06 180 top
C7  40.84,27.18 0 top
C8  45.72,27.18 180 top
C9  16.76,14.33 0 top
C10  16.76,19.13 0 top
C11  15.24,25.91 0 top
C12  6.99,25.78 180 top
C13  37.97,17.07 270 top
C14  30.4,10.79 90 top
C15  64.77,20.83 0 top
C16  6.99,41.27 0 top
D1  61.8,36.32 90 top
D2  22.25,2.74 180 top
D3  22.25,8.13 180 top
D4  22.25,5.44 180 top
D5  34.87,27.69 0 top
F1  6.93,30.33 180 top
J1  1.6,38.35 0 top
J2  8.89,11.43 270 top
J3  4.5,3.66 90 top
JP1  3.81,43.18 90 bottom
JP2  64.9,27.94 270 top
JP3  5.89,42.67 90 bottom
JP4  64.39,13.97 0 top
JP5  60.25,23.09 90 bottom
JP6  62.03,23.09 270 bottom
JP8  7.95,42.67 90 bottom
LED1  24.61,21.06 0 top
LED2  24.64,13.94 0 top
PAD1  1.8,2.67 90 top
PAD2  1.78,4.67 90 top
Q1  14.38,43.13 180 top
Q2  43.31,31.09 180 top
Q3  34.8,19.3 270 top
Q4  34.8,23.11 270 top
R1  25.53,32 0 top
R2  55.88,32 0 top
R3  25.53,29.46 180 top
R4  25.53,26.92 180 top
R5  15.24,27.97 180 top
R6  31.75,19.3 90 top
R7  37.97,20.09 90 top
R8  31.75,23.11 90 top
R9  37.97,23.11 90 top
R10  30.4,7.59 90 top
R11  55.88,29.21 0 top
R12  55.88,26.67 0 top
R13  31.75,27.79 90 top
R14  6.99,43.33 0 top
S1  5.28,48.87 0 top
U1  0,0 0 top
U2  12.7,35.31 90 top
U3  62.36,44.01 270 top
U4  38.1,39.75 0 top
U5  6.35,20.52 90 top
U6  11.05,26.92 90 top
U7  34.92,15.05 180 top
U8  35.05,9.63 270 top
U9  51.44,16.51 0 top
X1  5.28,48.87 0 top
X2  51.41,16.54 0 top
X3  68.31,13.97 180 top

### Tracks (layer width: path | path; a pad name or v marks a point on that pad's centre or on a via)
+3V3  (via drill 0.3)
  Top 0.254: U7.2 38.34,14.8 v38.66,14.48 | U7.10 U7.9 34.16,13.02 34.16,12.68 v34.2,12.64 | v12.29,37.59 12.12,37.41 v12.12,31.73 | v9.65,29.69 9.65,29.36 7.85,27.56 7.85,25.8 C12.1 | R13.1 32.5,26.94 32.69,27.13 32.69,27.46 v32.87,27.64
  Top 0.305: 30.49,11.63 C14.2 30.48,11.63 | 30.48,11.63 31.19,11.63 31.48,11.93 U8.1 32.15,11.91 v33.48,11.91 | 30.48,11.63 v29.26,11.63 | R12.1 50.85,26.67 v48.25,24.07
  Top 0.406: C13.2 37.96,16.23 38.71,16.23 v39.12,15.82 | 9.75,25.45 U6.5 | R6.2 30.77,20.15 v30.66,20.17
  Top 0.457: U6.5 8.9,25.97 8.71,25.78 C12.1
  Top 0.508: R10.2 29.68,8.45 v29.58,8.55
  Top 0.61: 33.6,23.96 Q4.1 | R6.2 33.6,20.15 Q3.1
  Top 0.813: 33.2,23.96 R8.2 31.05,23.96 v30,22.91 | 33.2,23.96 33.6,23.96 | U9.B12 U9.B4 | v35.84,25.12 34.77,24.05 33.29,24.05 33.2,23.96 | v18.85,22 18.47,22 16.08,24.38 10.82,24.38 9.75,25.45
  Bottom 0.254: v12.12,31.73 10.79,31.73 9.65,30.58 v9.65,29.69 | v32.87,27.64 32.87,26.14 33.27,25.73 35.23,25.73 v35.84,25.12
  Bottom 0.305: v39.12,15.82 38.66,15.37 v38.66,14.48 38.66,13.74 38.25,13.34 36.36,13.34 35.66,12.64 v34.2,12.64 v33.48,11.91 | v29.58,8.55 29.59,8.55 30.5,7.64 | JP8.1 7.95,41.78 8.31,41.43 11.15,41.43 12.12,40.46 12.12,37.77 v12.29,37.59
  Bottom 0.406: v30.68,15.37 30.68,15.27 30.66,15.24
  Bottom 0.61: R11.1 R12.1
  Bottom 0.813: C15.+ 63.75,19.43 61.82,17.5 U9.B12 | U9.B12 | v35.84,25.12 47.19,25.12 v48.25,24.07 54.81,17.5 U9.B12 | U1.3V 35.56,5.59 34.09,7.06 31.09,7.06 30.5,7.64 v29.58,8.55 29.26,8.87 v29.26,11.63 29.26,13.84 30.66,15.24 v30.66,20.17 30.66,22.25 v30,22.91 29.67,23.24 20.07,23.24 18.85,22.02 v18.85,22
+5V  (via drill 0.3)
  Top 0.254: 28.32,6.4 v29.4,5.32 | R14.2 8.94,43.33 v10.19,42.09 | v13.26,37.57 13.26,37.54 12.72,37.01 12.72,32.16 12.78,32.11 12.78,31.42 12.57,31.22 12.57,29.87 v12.42,29.72
  Top 0.305: 11.23,29.74 v11.2,29.72 11.23,29.72
  Top 0.406: v39.04,23.95 39.03,23.96 R9.2 37.97,24.71 v37.97,26.16 | v39.04,20.9 37.99,20.9 R7.2
  Top 0.457: v11.2,29.72 11.2,26.47 11.69,25.97 U6.1 14.38,25.97 C11.1
  Top 0.508: 17.5,28.42 17.7,28.22 | v18.34,23.42 18.44,23.52 18.44,27.51 v17.5,28.45
  Top 0.61: v17.5,28.45 17.5,28.42
  Top 0.762: 37.97,24.71 38.33,25.07 47.9,25.07 50.77,27.94 60.73,27.94 v62,29.21
  Top 0.813: U4.20 41.91,40.77 40.95,39.8 37.95,39.8 36.83,38.68 U4.7 36.83,33.96 v35.66,32.79 30.12,32.79 R1.2
  Top 1.016: v26.42,29.29 26.62,29.29 R1.2
  Top 1.27: v32.6,4.78 36.98,4.78 38.1,3.66 U1.5V
  Bottom 0.254: v10.19,42.09 10.31,41.96 11.38,41.96 12.68,40.66 12.68,38.15 v13.26,37.57
  Bottom 0.406: v39.04,23.95 v39.04,20.9 | JP2.2 66.17,31.5 65.66,32 62.93,32 62.36,32.58 61.8,32.58 61.27,32.04 61.27,29.95 v62,29.21
  Bottom 0.61: v11.2,29.72 v12.42,29.72 16.26,29.72 17.5,28.47 v17.5,28.45
  Bottom 0.813: v37.97,26.16 37.97,28.93 C6.1 35.84,32.61 v35.66,32.79
  Bottom 1.27: v32.6,4.78 29.95,4.78 | v26.42,29.29 22.55,25.4 20.32,25.4 v18.34,23.42 15.7,20.78 15.7,19.18 C10.+ 15.75,17.91 16.83,16.83 16.84,16.84 19.18,16.84 20.24,15.77 20.24,12.93 24.79,8.38 D3.C 24.79,7.62 | 29.95,4.78 v29.4,5.32 26.67,8.05 25.22,8.05 24.79,7.62 | 24.79,7.62 D4.C D2.C | U1.IOREF 30.48,4.24 29.95,4.78
A0  (via drill 0.3)
  Top 0.305: D1.C 60.21,33.77 58.17,35.81 v58.17,36.07 | v58.17,33.85 57.91,34.1 56.25,34.1 v56.13,34.24 | v45.91,33.59 48.07,33.59 48.64,33.02 51.56,33.02 52.07,32.51 R2.1 52.63,31.45 v55.75,31.45 | v37.85,34.1 38.29,34.1 v39.56,32.83
  Top 0.406: U4.23 34.29,41.88 35.04,41.13 35.04,37.53 35.57,36.99 35.57,34.66 35.05,34.14 v35.05,34.09 | v50.77,6.83 50.77,2.56 U1.A0
  Bottom 0.305: v58.17,36.07 v58.17,33.85 | v56.13,34.24 56.13,31.83 v55.75,31.45 | v45.91,33.59 40.32,33.59 v39.56,32.83
  Bottom 0.406: v35.05,34.09 34.29,34.09 | 34.29,34.09 33.55,34.09 33.27,33.81 33.12,33.81 32.82,33.5 32.28,33.5 31.75,32.97 31.75,26.44 38.79,19.41 40.62,19.41 42.49,17.53 42.49,9.42 45.09,6.83 v50.77,6.83 | v37.85,34.1 34.3,34.1 34.29,34.09
A1  (via drill 0.3)
  Top 0.305: U3.2 57.65,44.01 56.84,44.81 56.84,45.77 55.83,46.79 55.83,47.24 53.65,49.43 44.32,49.43 v44.15,49.61 | v30.96,47.35 31.75,46.56 U4.24
  Top 0.406: U4.24 31.75,41.27 32.99,40.03 v32.99,34.57 | v53.34,6.1 U1.A1
  Bottom 0.305: v44.15,49.61 43.56,49.61 43.31,49.86 42.72,49.86 42.39,49.53 33.15,49.53 v30.96,47.35
  Bottom 0.406: v32.99,34.57 32.56,34.14 32.03,34.14 31.11,33.22 31.11,26.19 38.53,18.77 40.34,18.77 41.86,17.25 41.86,9.17 44.83,6.2 50.39,6.2 50.49,6.1 v53.34,6.1
A2  (via drill 0.3)
  Top 0.406: U4.25 29.21,40.64 30.48,39.37 v30.48,34.59 | v55.88,5.33 U1.A2
  Bottom 0.406: v30.48,34.59 30.48,25.93 38.28,18.14 40.08,18.14 41.22,16.99 41.22,8.91 44.58,5.56 50.16,5.56 50.29,5.44 52.96,5.44 53.06,5.33 v55.88,5.33
A3  (via drill 0.3)
  Top 0.254: R13.2 31.75,29.74 30.79,30.71 v29.59,30.71
  Top 0.406: U4.26 26.67,40.01 27.91,38.76 v27.91,34.62 | v58.42,4.6 U1.A3 | R13.2 D5.1
  Bottom 0.254: v29.59,30.71 28.6,30.71 28.22,31.09
  Bottom 0.406: v27.91,34.62 27.91,33.63 28.22,33.33 28.22,31.09 28.22,26.49 28.93,25.78 29.74,25.78 38.02,17.5 39.83,17.5 40.59,16.74 40.59,8.66 44.32,4.93 49.94,4.93 50.09,4.78 52.76,4.78 52.86,4.67 55.5,4.67 55.58,4.6 v58.42,4.6
A4  (via drill 0.3)
  Top 0.406: U1.SDA 21.34,48.51 21.72,48.13 23.37,48.13 24.13,47.37 U4.27 24.13,38.63 25.38,37.39 v25.38,34.62 | R7.1 39.08,19.24 39.47,18.85 v39.47,16.79 | v60.96,3.86 U1.A4
  Top 0.813: Q3.3 37.91,19.3 R7.1
  Bottom 0.406: v25.38,34.62 25.91,34.09 26.54,34.09 27.58,33.05 27.58,26.24 28.68,25.15 29.49,25.15 37.85,16.79 v39.47,16.79 39.65,16.79 39.95,16.48 39.95,8.41 44.07,4.29 49.68,4.29 49.86,4.12 52.58,4.12 52.65,4.04 55.3,4.04 55.4,3.94 58.06,3.94 58.14,3.86 v60.96,3.86
A5  (via drill 0.3)
  Top 0.406: U1.SCL 18.8,49.15 19.81,48.13 20.83,48.13 21.59,47.37 U4.28 21.59,38.41 20.45,37.26 20.45,34.77 21.01,34.21 21.01,32.99 20.45,32.44 v20.45,29.67 | v29.41,24.21 30.3,25.09 v34.31,25.09 | v36.6,24.13 36.32,24.13 35.92,23.72 35.92,23.13 Q4.3 35.9,22.57 36.2,22.28 37.96,22.28 R9.1 39.13,22.26 39.75,21.64 v39.75,20.12 | v20.45,27.25 20.45,25.12 v21.34,24.23
  Bottom 0.406: v20.45,29.67 v20.45,27.25 | v21.34,24.23 21.46,24.11 29.31,24.11 v29.41,24.21 | v36.6,24.13 35.33,24.13 34.42,25.04 v34.31,25.09 | v39.75,20.12 40.82,20.12 43.13,17.78 43.13,9.68 45.34,7.47 50.37,7.47 50.49,7.59 51.05,7.59 51.82,6.83 53.62,6.83 54.36,6.1 54.38,6.1 54.41,6.07 56.19,6.07 56.95,5.31 62.43,5.31 63.5,4.24 U1.A5
AREF  (via drill 0.3)
  Top 0.254: 20.42,46.79 v20.6,46.79 19.63,45.82 v18.19,45.82
  Top 0.406: U1.AREF 23.88,49.66 24.66,48.87 28.93,48.87 29.65,48.15 31.29,48.15 31.93,47.51 33.58,47.51 34.21,46.88 35.87,46.88 36.49,46.25 38.12,46.25 38.72,45.66 38.98,45.66 39.34,45.29 39.34,43.59 U4.21
  Bottom 0.254: JP8.2 7.95,44.04 8.66,44.76 9.55,44.76 9.98,45.19 17.55,45.19 v18.19,45.82 | v20.6,46.79 21.31,46.79 22.61,48.08 23.22,48.08 23.95,48.82 23.95,50.72 U1.AREF
BUTTON  (via drill 0.3)
  Top 0.305: C16.1 5,41.27 2.69,43.59 v2.31,43.59
  Top 0.406: R14.1 C16.1
  Bottom 0.305: S1.3 2.03,46.02 2.69,45.36 2.69,43.59 | 2.69,43.59 3.1,43.18 JP1.2 | v2.31,43.59 2.69,43.59
CS_3V3  (via drill 0.3)
  Top 0.254: U9.A5 43.92,15.49 41.58,15.49 41.15,15.06 41.15,14.17 39.37,12.39 37.11,12.39 34.11,9.4 34.11,9.04 33.72,8.65 U8.6 | R12.2 v55.04,26.67 | v54.38,23.04 53.92,23.04 53.65,22.76 52.88,22.76 51.16,21.03 51.16,19.05 v51.44,18.77
  Top 0.305: U9.A13 U9.A5
  Bottom 0.254: v55.04,26.67 55.04,23.7 v54.38,23.04 | v51.44,18.77 50.55,18.77 50.04,18.26 50.04,17.98 47.57,15.52 U9.A13
D0  (via drill 0.3)
  Top 0.305: U2.2 18.36,32.13 v19.43,33.2
  Bottom 0.305: v19.43,33.2 19.61,33.07 20.57,33.07 21.11,33.6 23.72,33.6 24.13,34.01 U4.2
  Bottom 0.406: U4.2 24.13,37.64 24.71,38.23 46.71,38.23 47.65,39.17 50.24,39.17 50.39,39.32 58.04,39.32 60.6,41.88 60.6,47.62 61.52,48.54 62.64,48.54 63.5,49.4 U1.D0
D1  (via drill 0.3)
  Top 0.305: U2.3 17.4,33.4 v17.98,32.82 | v26.67,32.92 U4.3
  Top 0.406: U4.3 v26.67,38.96
  Bottom 0.305: v17.98,32.82 18.26,32.54 20.78,32.54 21.31,33.07 26.54,33.05 v26.67,32.92
  Bottom 0.406: v26.67,38.96 26.77,38.86 46.46,38.86 47.4,39.8 49.99,39.8 50.16,39.98 57.78,39.98 59.97,42.16 59.97,47.9 60.96,48.9 U1.D1
D2  (via drill 0.3)
  Top 0.305: U9.B11 U9.B3 | v57.12,37.13 57.12,40.69 v57.23,40.79
  Top 0.406: U4.4 v29.21,39.6
  Bottom 0.305: U9.B11 | U9.B11 56.9,20.55 56.9,21.84 56.36,22.38 56.36,24.16 56.87,24.66 56.87,36.88 v57.12,37.13
  Bottom 0.406: v29.21,39.6 29.31,39.5 46.2,39.5 47.14,40.44 49.73,40.44 49.91,40.62 57.05,40.62 v57.23,40.79 57.51,41.07 57.99,41.07 59.33,42.42 59.33,47.95 58.42,48.87 U1.D2 58.4,50.77
D3  (via drill 0.3)
  Top 0.305: U9.B10 U9.B2 | v58.12,37.13 58.12,40.92 v57.1,41.94
  Top 0.406: U4.5 v31.75,40.23
  Bottom 0.305: U9.B10 57.94,21.54 56.9,22.58 56.9,23.95 57.4,24.46 57.4,36.42 v58.12,37.13
  Bottom 0.406: v31.75,40.23 31.85,40.13 45.95,40.13 46.89,41.07 49.48,41.07 49.68,41.27 56.44,41.27 v57.1,41.94 57.96,41.94 58.7,42.67 58.7,47.7 57.86,48.54 56.74,48.54 55.88,49.4 U1.D3
D4  (via drill 0.3)
  Top 0.254: 20.95,39.17 20.95,41.88 20.45,42.39 20.45,42.85 19.84,43.46 19.28,43.46 v16.89,45.85
  Top 0.305: v48.62,41.78 48.84,41.58 48.84,39.67 50.11,38.41 50.11,38.02 50.29,37.85 52.83,37.85 53.34,37.34 53.34,34.8 54.61,33.53 57.54,33.53 v58.17,32.91 58.14,32.88
  Top 0.406: U4.6 v34.29,40.84 | v20.65,38.86 20.95,39.17
  Bottom 0.254: v16.89,45.85 16.71,45.67 9.75,45.67 9.32,45.24 4.14,45.24 3.81,44.91 JP1.3
  Bottom 0.305: 57.94,32.67 v58.17,32.91 57.94,32.68 57.94,24.94 58.47,24.41 60.05,24.41 60.25,24.21 JP5.2 | v48.62,41.78 48.62,41.76 48.26,42.11
  Bottom 0.406: U1.D4 53.34,46.41 52.88,45.95 49.58,45.95 48.26,44.63 48.26,42.11 47.85,41.71 46.63,41.71 45.7,40.77 34.37,40.77 v34.29,40.84 32.21,40.84 32.08,40.97 31.45,40.97 30.84,40.36 28.91,40.36 28.27,39.73 26.39,39.73 25.53,38.86 v20.65,38.86
D5  (via drill 0.3)
  Top 0.254: v63.32,23.5 62.33,22.5 56.92,22.5 56.54,22.12 v54.38,22.12
  Top 0.406: v50.8,46.79 v50.8,38.51
  Bottom 0.254: U4.11 46.99,34.82 49.05,32.77 49.05,26.92 53.85,22.12 v54.38,22.12 | v63.32,23.5 JP6.1
  Bottom 0.406: U1.D5 v50.8,46.79 | v50.8,38.51 47.88,38.51 46.99,37.62 U4.11
D6  (via drill 0.3)
  Top 0.254: v39.19,8 47.8,8 49.61,9.8 49.61,21.67 52.4,24.46 v52.93,24.46 | v34.8,9.07 33.73,8 U8.7
  Top 0.406: U4.12 49.53,38.18 48.26,39.45 48.26,41.07 47.9,41.43 47.9,42.14 48.26,42.49 v48.26,46.14
  Bottom 0.254: U4.12 49.53,27.13 52.2,24.46 v52.93,24.46 | v34.8,9.07 38.12,9.07 v39.19,8
  Bottom 0.406: U1.D6 v48.26,46.14
D7  (via drill 0.3)
  Top 0.406: v45.72,45.16 45.72,42.32 47.62,40.41 47.62,39.19 48.77,38.05 v48.77,37.8
  Bottom 0.305: 51.56,37.8 52.5,38.73 58.32,38.73 61.19,41.6 61.19,45.38 U3.1
  Bottom 0.406: 52.09,35.97 U4.13 52.07,37.47 51.74,37.8 51.56,37.8 v48.77,37.8 | U1.D7 v45.72,45.16
D8  (via drill 0.3)
  Top 0.254: 12.57,28.1 12.57,28.7 13.13,29.26 13.13,31.04 13.36,31.27 13.36,36.68 13.97,37.29 13.97,38.02 v13.41,38.58
  Top 0.305: 12.57,28.1 U6.3
  Top 0.406: U4.14 54.61,41.06 55.74,42.19 55.74,44.73 55.26,45.21 55.26,46.99 53.39,48.84 43.33,48.84 v43,49.17 42.8,49.38 41.99,49.38 41.66,49.71 U1.D8 | R5.2 12.5,27.96 12.39,27.86 | 12.72,27.96 12.7,27.94 12.41,27.94 U6.3
  Top 0.457: U6.3 14.3,27.87 R5.2
  Bottom 0.305: v43,49.17 42.72,48.9 42.06,48.9 39.6,46.43 34.24,46.43 33.91,46.1 26.29,46.1 25.38,45.19 25.38,42.29 24.77,41.68 15.01,41.68 13.41,40.08 v13.41,38.58
D9  (via drill 0.3)
  Top 0.254: v29.08,21.61 28.75,21.95 28.75,24.56 30.1,25.91 36.6,25.91 38.96,28.27 v38.96,28.37 | v38.05,37.41 38.05,38.56 38.53,39.04 41.27,39.04 42.67,40.44 42.67,41.99 43.18,42.49 v43.18,44.86 | v32.47,14.21 30.82,14.21 v29.03,16
  Top 0.305: U7.12 v35.17,13.4 v35.18,13.4
  Top 0.406: U1.D9 39.12,49.71 40.06,48.77 41.83,48.77 v42.39,48.21 53.11,48.21 54.61,46.71 U4.15
  Bottom 0.254: v29.03,16 29.27,16.24 29.27,21.43 v29.08,21.61 | v38.96,28.37 38.73,28.6 38.73,34.12 38.05,34.81 v38.05,37.41 | v42.39,48.21 42.72,47.8 43.18,47.35 v43.18,44.86 | v35.18,13.4 34.37,14.21 v32.47,14.21
D10  (via drill 0.3)
  Top 0.254: v19.58,42.57 19.58,42.55 20.45,41.68 20.45,39.62 19.99,39.17 19.99,37.62 19.89,37.52 19.89,35 18.97,34.09 v17.27,34.09 | v18.54,31.32 18.54,30.56 20.27,28.83 21.08,28.83 R3.2
  Top 0.305: v25.17,46.56 28.12,46.56 v28.37,46.81
  Top 0.406: U1.D10 36.58,49.71 37.44,48.84 v38.1,48.84 39.06,48.84 39.78,48.13 41.45,48.13 42.09,47.5 51.31,47.5 52.07,46.74 U4.16
  Bottom 0.254: v25.17,46.56 21.82,46.56 20.34,45.09 20.34,43.33 v19.58,42.57 | v18.54,31.32 17.27,32.59 v17.27,34.09
  Bottom 0.305: v28.37,46.81 28.55,46.63 33.68,46.63 34.04,46.99 36.25,46.99 v38.1,48.84 | 36.55,50.77 U1.D10
D11  (via drill 0.3)
  Top 0.254: U8.3 33.47,10.6 v33.48,10.59 | v39.06,9.93 41.22,9.93 41.81,10.52 47.8,10.52 49.12,11.84 49.12,21.89 52.35,25.12 53.72,25.12 54.23,25.63 61.65,25.63 62.69,26.67 64.9,26.67 JP2.4
  Top 0.305: v56.01,45.62 56.01,45.26 56.31,44.96 56.31,36.85 61.37,31.8 v62.05,31.8
  Top 0.406: U1.D11 34.04,49.71 34.98,48.77 36.63,48.77 37.26,48.13 38.89,48.13 39.51,47.51 41.2,47.51 41.85,46.86 48.87,46.86 49.51,46.23 49.51,43.59 U4.17
  Bottom 0.254: v33.48,10.59 38.41,10.59 v39.06,9.93
  Bottom 0.305: U4.17 49.53,44.88 50.01,45.36 55.75,45.36 v56.01,45.62 | v62.05,31.8 62.05,30.18 63.02,29.21 64.9,29.21 JP2.4
D12  (via drill 0.3)
  Top 0.254: U9.A10 48.05,21.51 52.17,25.63 52.48,25.63 v53.52,26.67
  Top 0.305: U9.A10 U9.A2 | v45.41,41.55 45.67,41.55 47.04,40.18 47.04,38.96 48.08,37.92 48.08,37.47 48.28,37.26 48.28,34.95 49.1,34.14 52.91,34.14 54.28,32.77 v54.76,32.77 57.15,32.77 v58.67,31.24 | v60.55,30.86 63.25,30.86 JP2.1
  Top 0.406: U1.D12 31.5,49.71 32.44,48.77 34.09,48.77 34.72,48.13 36.37,48.13 37.01,47.5 38.63,47.5 39.24,46.89 40.93,46.89 41.59,46.23 46.51,46.23 46.99,45.74 U4.18
  Bottom 0.305: U4.18 46.99,43.13 v45.41,41.55 | v58.67,31.24 59.05,30.86 v60.55,30.86 | v53.52,26.67 53.52,31.19 54.34,32.02 54.59,32.26 54.76,32.44 v54.76,32.77
D13  (via drill 0.3)
  Top 0.254: v33.45,9.3 U8.5
  Top 0.305: U4.19 44.45,41.55 45.9,40.11 45.9,34.75 46.51,34.14 48.34,34.14 48.87,33.6 52.32,33.6 53.82,32.11 57.05,32.11 57.91,31.24 57.91,30.99 v58.67,30.23
  Top 0.406: U1.D13 28.96,49.73 29.92,48.77 31.55,48.77 32.18,48.13 33.83,48.13 34.47,47.5 36.12,47.5 36.74,46.88 38.38,46.88 38.98,46.28 40.66,46.27 41.33,45.61 44.03,45.61 44.45,45.19 U4.19 | v22.86,47.37 22.86,31.57 23.5,30.94 23.5,26.67 24.77,25.4 24.77,22.35 v24.66,22.25 | v28.25,14.17 28.93,13.49 v31.55,13.49
  Bottom 0.254: 33.43,9.3 v33.45,9.3 32.69,10.06 32.69,13.13 32.33,13.49 v31.55,13.49 | v58.67,30.23 58.45,30 58.45,28.4 58.9,27.94 JP2.3
  Bottom 0.406: v22.86,47.37 27.86,47.37 28.98,48.49 28.98,50.77 U1.D13 | v24.66,22.25 24.82,22.4 29.34,22.38 29.82,21.89 29.82,15.75 v28.25,14.17
D+  (via drill 0.3)
  Top 0.305: J1.D+1 v6.6,38.35 | U2.5 14.33,35.94 v14.22,36.04
  Bottom 0.305: v6.6,38.35 8.33,36.63 9.98,36.63 10.57,36.04 v14.22,36.04
D-  (via drill 0.3)
  Top 0.305: v16.79,37.21 U2.6 | v6.59,39.18 6.18,39.18 6.01,39 J1.D-1
  Bottom 0.305: v6.59,39.18 6.72,39.18 7.29,38.61 7.29,38.41 8.36,37.34 10.39,37.34 10.95,36.78 13.79,36.78 14.22,37.21 v16.79,37.21
GND  (via drill 0.3)
  Top 0.254: 32.72,17.5 29.06,17.27 v28.17,16.03
  Top 0.305: J1.GND1 4.7,37.05 4.98,36.78 4.98,36.14 v4.9,36.07 | U7.8 33.08,15.3 | 33.08,15.3 33.02,15.24 | U7.7 33.58,15.8 33.08,15.3 | U7.6 34.67,16.58 34.73,16.64 | U7.3 36.19,15.3 36.39,15.49 36.39,17.14
  Top 0.406: 32.96,17.25 32.72,17.5
  other vias: 7.75,39.17 39.95,6.78 67.59,31.55 25.53,26.52 35.69,45.72 34.7,45.72 46.48,23.55 47.19,23.55 46.56,9.5 47.32,9.5 56.24,11.53 55.47,11.53 55.98,35.57 13.31,48.87 16.97,30.43 12.6,16.56 10.97,16.56 18.72,12.73 32.23,6.02 36.6,6.02 63.45,12.29 63.45,11.51 63.47,10.67 63.42,9.88 63.68,15.6 62.89,15.6 62.1,15.6 65.43,23.57 66.45,23.57 52.55,47.37 57.12,43.1 46.86,16.46 63.12,9.14 62.59,8.51 61.87,8.08 61.04,8.03 60.2,8.03 59.39,8.03 35.05,8.1 16.1,26.92 16.97,48.87 54.43,30.63 39.83,29.16 22.63,49.25 18.82,40.36 18.21,42.6 17.55,40.36 17.55,39.09 17.55,37.82 18.67,10.06 29.64,47.37 30.45,45.29 21.21,28.12 25.53,40.49 8.53,8.51 20.35,21.62 52.5,30.63 50.39,29.69 50.42,30.76 50.42,31.8 62.2,19.76 62.2,21.03 67.28,18.49 66.01,18.49 64.74,18.49 20.37,20.42 20.37,19.15 20.37,17.88 11.86,17.91 7.26,8.51 5.99,8.51 26.54,3.94 21.72,1.3 21.72,4.04 41.86,4.32 47.47,3.12 47.47,1.85 66.52,4.39 65.48,3.33 48.16,28.57 59.92,38.84 59.94,37.69 64.62,42.42 64.57,43.69 64.59,44.98 43.69,50.98 40.59,45.03 38.1,41.63 10.24,44.48 4.65,31.67 1.96,29.87 7.04,14.63 5.66,6.68 6.38,3.23 11.46,3.23 16.54,1.96 27.2,5.82 27.33,10.39 24.59,31.7 24.59,19 24.59,17.73 24.23,28.75 40.84,23.55 51.94,13.92 51.94,12.65 47.4,13.39 43.54,41.63 40.59,41.63 64.11,39.78 64.11,38.56 53.82,37.97 55.45,37.97 57.76,45.19 54.66,49.76 39.5,31.22 17.45,25.91 15.75,23.09 21.69,7.52 28.35,18.87 27.33,24.89 27.89,40.54 30.48,41.22 25.37,9.55 23.32,19 23.32,17.73 31.57,12.62 50.67,8.84 51.94,8.84 55.78,30.28 53.54,20.55 54.81,20.55 3.23,33.68 3.23,32.41 23.32,16.46 40.84,22.28 61.42,26.92 55.6,23.19 36.63,16.1 34.59,17.09 37.24,32.54 48.13,29.62 48.11,30.66 24.26,12.4 14.5,42.27 4.01,46.25 0.81,45.29 40.64,34.52 27.81,8.81 27.33,48.13 27.74,49.81 25.1,49.83 30.23,49.83 54.89,16.28 17.55,36.55 36.04,28.98 34.62,29.84 37.26,31.27 46.86,29.62 33.07,41.71 18.8,39.09 18.77,37.85 50.93,13.92 50.93,12.7 50.93,11.43 50.93,10.16 51.94,11.38 51.94,10.11 48.13,17.73 48.13,19 48.13,20.27 19.48,45.14
  pour Top (rank 6): 0,53.34 0,0 81.28,0 81.28,53.34
  pour Bottom (rank 4): 81.28,53.34 81.28,0 0,0 0,53.34
MOSI_3V3
  Top 0.254: U8.2 34.62,11.25 36.73,13.36 38.99,13.36 40.18,14.55 40.18,15.44 40.66,15.93 40.66,17.27 41.15,17.75 41.15,19.07 41.55,19.48 43.91,19.48 U9.A3
  Top 0.305: U9.A11 U9.A3
N$1
  Top 0.813: U4.9 41.91,32.11 Q2.2
  Top 1.016: C7.2 42.11,29.87 Q2.2
N$2
  Top 0.813: U4.10 44.45,32.36 Q2.1
  Top 1.016: C8.2 44.45,29.82 Q2.1
N$3
  Top 0.305: C1.2 13.66,44.83 Q1.2
  Top 0.406: U2.7 14.43,38.48 14.15,38.76 14.15,40.95 Q1.2
N$4
  Top 0.305: C2.2 16.13,43.79 Q1.1
  Top 0.406: U2.8 15.39,41.73 Q1.1
N$5  (via drill 0.3)
  Top 0.305: v5,33.96 5,34.04 5.33,34.37 6.11,34.37 C3.1 | U2.4 v14.22,34.67
  Bottom 0.254: v5,33.96 5.44,34.39 13.95,34.39 v14.22,34.67
N$6  (via drill 0.3)
  Top 0.61: R3.1 26.8,26.92 26.8,25.65 26.16,25.04 v25.7,25.04 | v23.93,25.02 23.34,24.43 LED1.A
  Bottom 0.61: v25.7,25.04 23.95,25.04 v23.93,25.02
N$7
  Top 0.406: LED2.A 23.47,13.95 27.43,17.91 27.43,22.12 28.19,22.89 28.19,24.79 29.34,25.93 R4.1
N$8
  Top 0.305: U2.13 8.97,34.67 8.84,34.8 8.84,36.42 8.69,36.58 C5.2
N$9  (via drill 0.3)
  Top 1.27: D4.A 18.69,5.44 16.51,7.62 11.89,7.62 9.8,9.7 9.8,14.61 8.08,16.33 8.08,16.36 7.62,16.82 6.83,16.82 6.81,16.84
  other vias: 1.27,23.42 2.54,23.42 3.81,23.42 5.08,23.42 6.35,23.42 1.27,22.15 1.27,20.88 1.27,19.61 1.27,18.34 1.27,17.07 2.54,17.07 3.81,17.07 5.08,17.07 6.35,17.07
  pour Bottom: 0.33,16 0.33,28.17 7.37,28.17 7.37,16
  pour Top: 0.33,24.36 0.33,16 7.37,16 7.37,19.46 9.8,19.46 9.8,21.23 7.37,21.23 7.37,24.36
N$10  (via drill 0.3)
  Top 0.305: J1.VBUS1 v2.9,39.65
  Top 0.61: F1.2 v4.93,30.33
  Bottom 0.61: v2.9,39.65 2.87,39.65 2.29,39.06 2.29,32.07 4.03,30.33 v4.93,30.33
N$11
  Top 0.305: U9.B16 U9.B8
  Top 1.27: U9.B8 61.05,9.51 arc90 61.98,10.44 61.98,12.29 arc-90 JP4.1 X3.P
N$12  (via drill 0.3)
  Top 0.305: 5.89,44.5 v5.89,44.55 5.36,45.09 v1.88,45.09
  Bottom 0.305: R4.2 21.26,26.92 20.83,26.49 20.19,26.49 19.74,26.95 17.98,26.95 15.93,29.01 4.37,29.01 1.57,31.8 1.57,44.78 v1.88,45.09 | JP3.1 v5.89,44.55
N$13
  Top 0.254: U9.B1 U9.B9
  Bottom 0.305: JP5.1 58.76,22.68 | 58.76,22.68 U9.B9 | 58.76,22.68 58.75,22.68 57.94,23.5
N$14  (via drill 0.3)
  Top 0.254: R10.1 34,6.75 34.54,7.29 35.48,7.29 36.22,8.03 36.22,9.78 37.03,10.59 U8.14 37.98,10.62 39.24,10.62 41.15,12.52 47.95,12.52 48.64,13.21 48.64,13.97 48.34,14.28 v48.28,14.28 | v55.17,18.52 52.55,18.52 v52.2,18.16
  Bottom 0.254: 62.03,22.38 61.19,21.54 61.19,18.85 60.86,18.52 v55.17,18.52 | v52.2,18.16 51.89,18.16 51.16,17.42 50.93,17.42 48.28,14.78 v48.28,14.28
  Bottom 0.305: JP6.2 62.03,22.38
N$25
  Top 0.305: U9.A15 U9.A7
N$30
  Top 0.305: U9.B13 U9.B5
N$31
  Top 0.305: U9.B14 U9.B6
RESET  (via drill 0.3)
  Top 0.254: v33.88,5.92 34.72,6.76 38.91,6.76 39.65,7.49 48.01,7.49 50.11,9.6 50.11,21.46 52.43,23.77 53.21,23.77 54.56,25.12 61.95,25.12 62.23,25.4 JP2.5
  Top 0.305: C5.1 6.13,37.15 v5.64,37.64 | U1.RESET 31.27,4.29 27.64,4.29 26.26,5.66 26.26,10.16 v26.07,10.35 24.97,11.46 23.67,11.46 22.12,13.01 22.12,25.86 22.76,26.49 v22.76,30.45 21.72,31.5 R1.1 | v20.24,33.91 20.24,33.05 19.86,32.66 19.86,30.73 v19.58,30.45
  Bottom 0.254: v33.88,5.92 33.88,3.4 U1.RESET | v28.32,9.73 26.7,9.73 v26.07,10.35
  Bottom 0.305: U4.1 21.59,34.9 20.6,33.91 v20.24,33.91 18.82,35.33 10.06,35.33 9.3,36.09 8.13,36.09 6.58,37.64 v5.64,37.64 5.21,37.64 4.75,38.1 4.75,41.05 3.81,41.99 JP1.1 | v19.58,30.45 19.61,30.45 19.79,30.63 22.58,30.63 v22.76,30.45
RST_3V3  (via drill 0.3, 0.3 pad 0.3)
  Top 0.254: U8.15 38.89,11.25 41.17,13.51 U9.A6 | R11.2 v54.36,29.21 | v54.36,23.95 54.23,24.05 53.42,23.24 52.65,23.24 50.65,21.23 50.65,18.26 v50.85,18.06
  Bottom 0.254: v54.36,29.21 v54.36,23.95 | v50.85,18.06 50.85,18.03 46.33,13.51 U9.A14
SCK_3V3
  Top 0.254: U8.4 33.98,9.95 36.91,12.88 39.17,12.88 40.66,14.38 40.66,15.24 41.15,15.72 41.15,17.09 41.55,17.5 43.93,17.5 U9.A4
  Top 0.305: U9.A12 U9.A4
SCL_3V3  (via drill 0.3)
  Top 0.305: 32.74,22.26 32.64,22.16 31.92,22.16 31.83,22.07 v31.83,21.23 | U7.1 37.2,14.3 v37.4,14.1
  Top 0.61: R8.1 32.74,22.26 33.6,22.26 Q4.2
  Bottom 0.305: v31.83,21.23 32.59,21.23 32.59,21.2 37.4,16.38 37.4,15.24 v37.4,14.1
SDA_3V3  (via drill 0.3)
  Top 0.305: v32.69,19.28 32.69,18.48 32.72,18.45 | U7.4 v35.69,17.08
  Top 0.61: R6.1 32.72,18.45 33.6,18.45 Q3.2
  Bottom 0.305: v32.69,19.28 33.76,19.28 35.69,17.35 v35.69,17.08
USB_VCC  (via drill 0.3)
  Top 0.254: v11.18,30.86 11.25,30.94 11.25,31.83 11.61,32.18 11.61,37.31 v11.33,37.59
  Top 0.305: U2.16 8.87,30.86 8.46,30.45 7.96,30.45 F1.1
  Top 0.406: C3.2 C4.1 F1.1
  Top 0.508: 7.82,30.32 F1.1 | v11.18,30.86 U2.16 | D3.A 21.46,9.88 21.46,22.94 19.48,24.92 19.48,27.89 18.11,29.26 14.86,29.26 13.89,30.23 v13.89,30.86
  Bottom 0.305: 5.89,42.16 5.89,41.5 6.53,40.87 10.97,40.87 11.58,40.26 11.58,37.85 v11.33,37.59
  Bottom 0.508: v13.89,30.86 v11.18,30.86
VBAT
  Top 1.27: PAD2.1 4.48,4.67 J3.2 12.1,4.66 12.85,5.41 15.06,5.41 17.73,2.74 D2.A
VIN  (via drill 0.3)
  Top 0.813: U1.VIN 44.15,0.96 24.43,0.96 v22.86,2.54
  Top 1.27: J2.1 12.85,11.43 C9.+
  Top 1.422: U5.3 v12.55,22.84
  Bottom 0.813: v22.86,2.54 22.86,8.38 19.81,11.43 J2.1
  Bottom 1.676: v11.46,22.86 v12.55,22.84 12.78,22.63 13.61,21.79 13.61,17.58 15.75,15.44 C9.+ 15.7,14.28

### Text on the board
tNames: ~ | ~ | ~ | ~ | ~ | ~ | BUTTON | °C SENSOR | LIGHT / SENSOR | USB PWR / PROGRAM | U2 | ICSP | x | z | y | ANT | 6-12V / DC IN | + | 3.5- / 4.5V / BAT
bNames: D4 | Button: RESET | Power LED | 3V3 AREF | D4 | D5 | | UNO | DIO2 | RES | v2.0, More info on: / dramco.be/dramco-uno / by Guus Leenders | Engineering Tech / Electronics / ICT / Campus Ghent